# Altium schematic sheet DIY键盘V2.SchDoc
size 381 x 241 mm; SheetNumber: 1; SheetTotal: 1
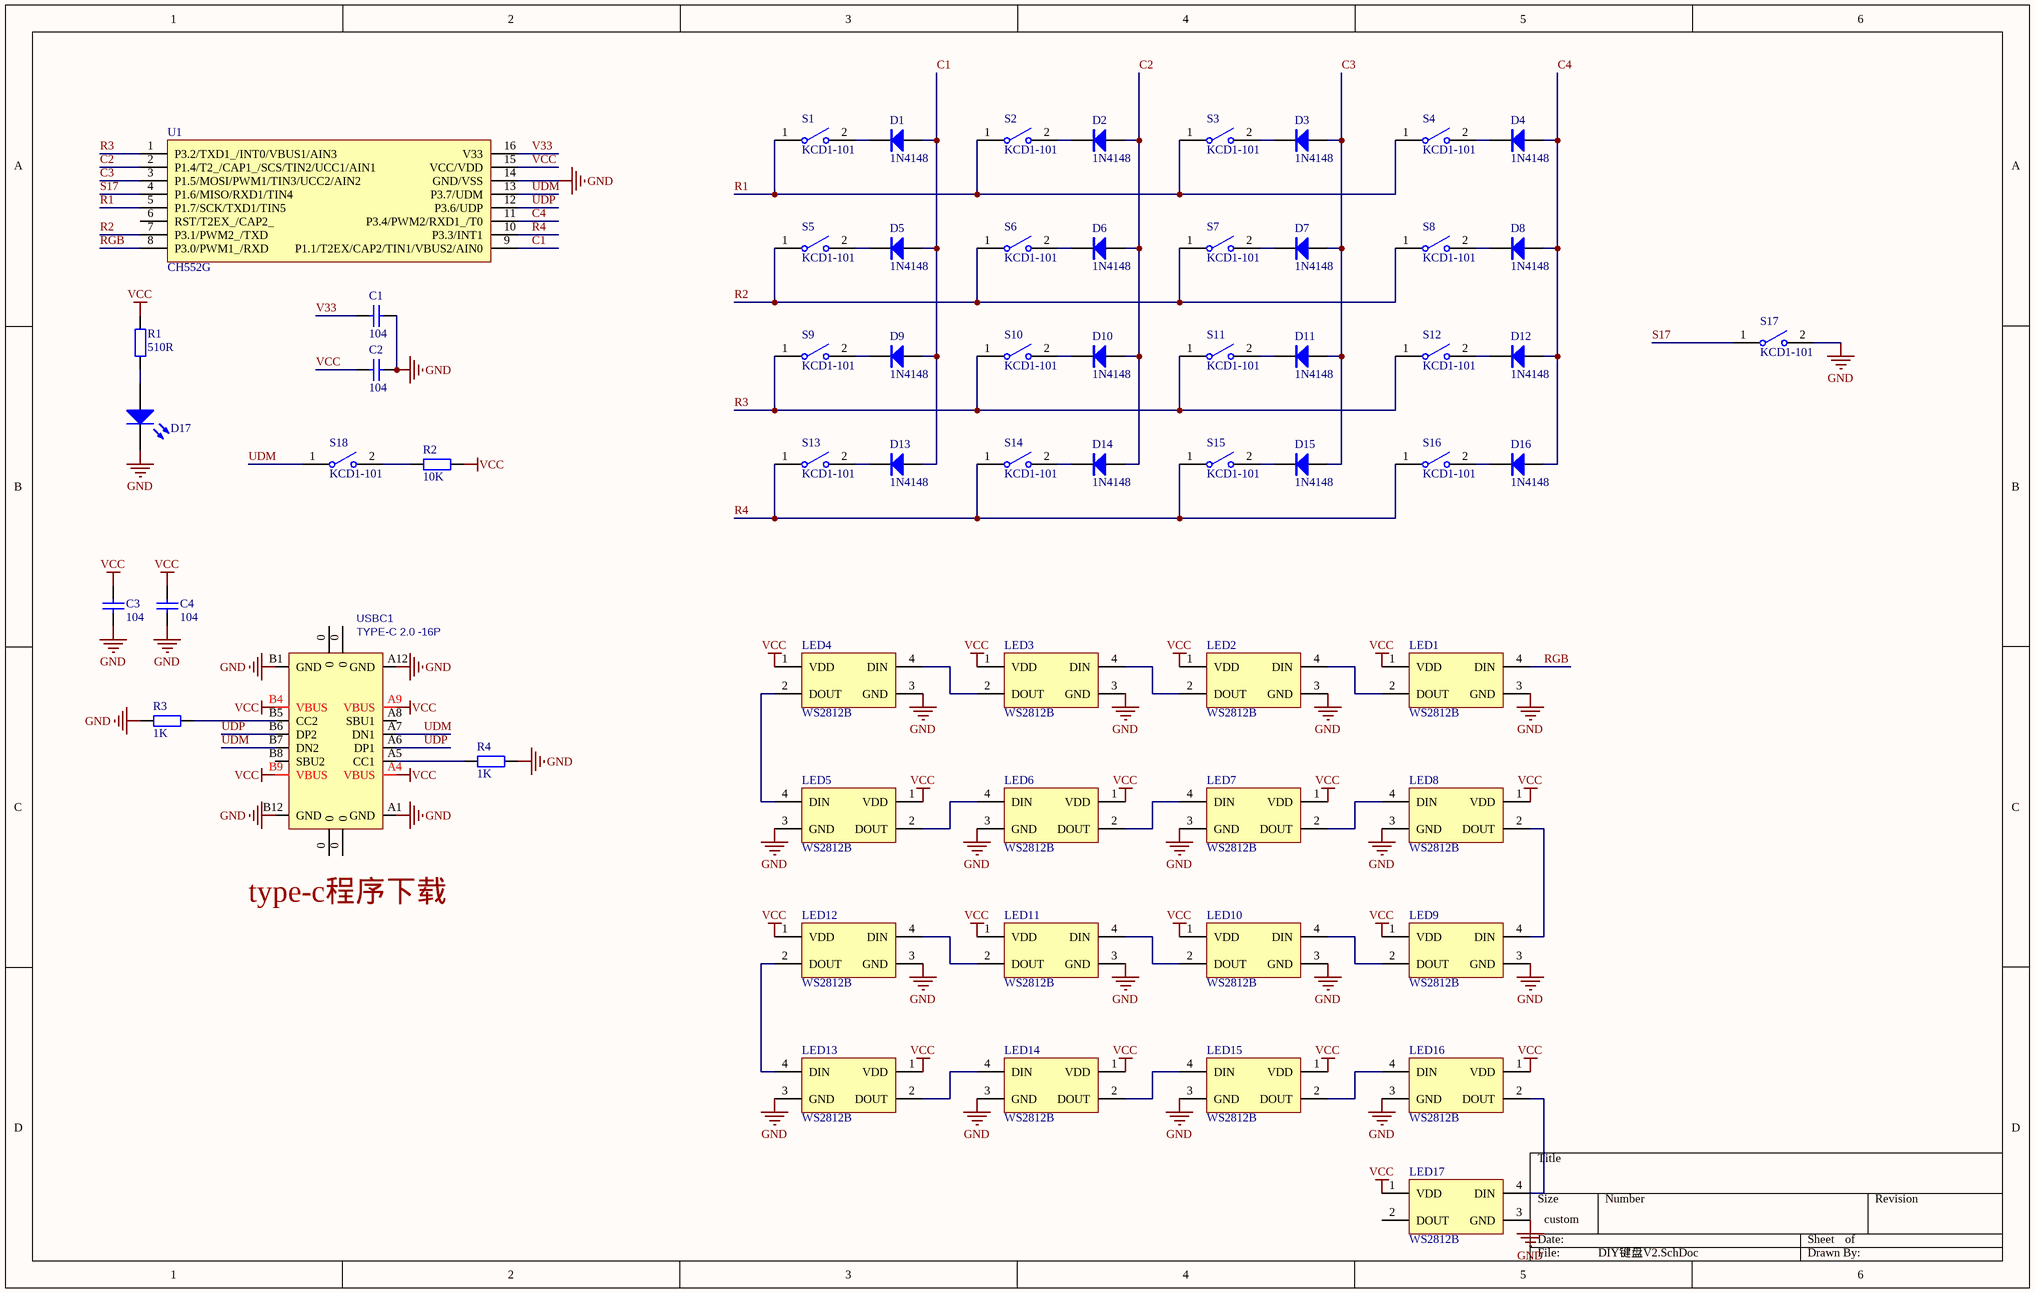
[diagram p0: DIY键盘V2.SchDoc]

## Parts
C1  104  [C0603_M]
C2  104  [C0603_M]
C3  104  [C0603_M]
C4  104  [C0603_M]
D1  1N4148  [SOD-323]
D2  1N4148  [SOD-323]
D3  1N4148  [SOD-323]
D4  1N4148  [SOD-323]
D5  1N4148  [SOD-323]
D6  1N4148  [SOD-323]
D7  1N4148  [SOD-323]
D8  1N4148  [SOD-323]
D9  1N4148  [SOD-323]
D10  1N4148  [SOD-323]
D11  1N4148  [SOD-323]
D12  1N4148  [SOD-323]
D13  1N4148  [SOD-323]
D14  1N4148  [SOD-323]
D15  1N4148  [SOD-323]
D16  1N4148  [SOD-323]
D17  LED  [LED0603_B]  (value not drawn)
LED1  WS2812B  [LED-SMD_L3.2-W2.8-BR_DY-S352818]
LED2  WS2812B  [LED-SMD_L3.2-W2.8-BR_DY-S352818]
LED3  WS2812B  [LED-SMD_L3.2-W2.8-BR_DY-S352818]
LED4  WS2812B  [LED-SMD_L3.2-W2.8-BR_DY-S352818]
LED5  WS2812B  [LED-SMD_L3.2-W2.8-BR_DY-S352818]
LED6  WS2812B  [LED-SMD_L3.2-W2.8-BR_DY-S352818]
LED7  WS2812B  [LED-SMD_L3.2-W2.8-BR_DY-S352818]
LED8  WS2812B  [LED-SMD_L3.2-W2.8-BR_DY-S352818]
LED9  WS2812B  [LED-SMD_L3.2-W2.8-BR_DY-S352818]
LED10  WS2812B  [LED-SMD_L3.2-W2.8-BR_DY-S352818]
LED11  WS2812B  [LED-SMD_L3.2-W2.8-BR_DY-S352818]
LED12  WS2812B  [LED-SMD_L3.2-W2.8-BR_DY-S352818]
LED13  WS2812B  [LED-SMD_L3.2-W2.8-BR_DY-S352818]
LED14  WS2812B  [LED-SMD_L3.2-W2.8-BR_DY-S352818]
LED15  WS2812B  [LED-SMD_L3.2-W2.8-BR_DY-S352818]
LED16  WS2812B  [LED-SMD_L3.2-W2.8-BR_DY-S352818]
LED17  WS2812B  [LED-SMD_L3.2-W2.8-BR_DY-S352818]
R1  510R  [R0603_M]
R2  10K  [R0603_M]
R3  1K  [R0603_M]
R4  1K  [R0603_M]
S1  KCD1-101  [KEY-TH_CPG1511F01S0X]
S2  KCD1-101  [KEY-TH_CPG1511F01S0X]
S3  KCD1-101  [KEY-TH_CPG1511F01S0X]
S4  KCD1-101  [KEY-TH_CPG1511F01S0X]
S5  KCD1-101  [KEY-TH_CPG1511F01S0X]
S6  KCD1-101  [KEY-TH_CPG1511F01S0X]
S7  KCD1-101  [KEY-TH_CPG1511F01S0X]
S8  KCD1-101  [KEY-TH_CPG1511F01S0X]
S9  KCD1-101  [KEY-TH_CPG1511F01S0X]
S10  KCD1-101  [KEY-TH_CPG1511F01S0X]
S11  KCD1-101  [KEY-TH_CPG1511F01S0X]
S12  KCD1-101  [KEY-TH_CPG1511F01S0X]
S13  KCD1-101  [KEY-TH_CPG1511F01S0X]
S14  KCD1-101  [KEY-TH_CPG1511F01S0X]
S15  KCD1-101  [KEY-TH_CPG1511F01S0X]
S16  KCD1-101  [KEY-TH_CPG1511F01S0X]
S17  KCD1-101  [KEY-TH_CPG1511F01S0X]
S18  KCD1-101  [SW SMD-3*6*2.5]
U1  CH552G  [SOP-16_L10.0-W3.9-P1.27-LS6.0-BL]
USBC1  TYPE-C 2.0 -16P  [USB-C-SMD_16P]

## Nets
GND: C1.1 C2.1 C3.1 C4.1 D17.2(K) LED1.3(GND) LED2.3(GND) LED3.3(GND) LED4.3(GND) LED5.3(GND) LED6.3(GND) LED7.3(GND) LED8.3(GND) LED9.3(GND) LED10.3(GND) LED11.3(GND) LED12.3(GND) LED13.3(GND) LED14.3(GND) LED15.3(GND) LED16.3(GND) LED17.3(GND) R3.2 R4.2 S17.2 U1.14(GND/VSS) USBC1.A1(GND) USBC1.A12(GND) USBC1.B1(GND) USBC1.B12(GND)
VCC: C2.2 C3.2 C4.2 LED1.1(VDD) LED2.1(VDD) LED3.1(VDD) LED4.1(VDD) LED5.1(VDD) LED6.1(VDD) LED7.1(VDD) LED8.1(VDD) LED9.1(VDD) LED10.1(VDD) LED11.1(VDD) LED12.1(VDD) LED13.1(VDD) LED14.1(VDD) LED15.1(VDD) LED16.1(VDD) LED17.1(VDD) R1.2 R2.2 U1.15(VCC/VDD) USBC1.A4(VBUS) USBC1.A9(VBUS) USBC1.B4(VBUS) USBC1.B9(VBUS)
C1: D1.1(A) D5.1(A) D9.1(A) D13.1(A) U1.9(P1.1/T2EX/CAP2/TIN1/VBUS2/AIN0)
C2: D2.1(A) D6.1(A) D10.1(A) D14.1(A) U1.2(P1.4/T2_/CAP1_/SCS/TIN2/UCC1/AIN1)
C3: D3.1(A) D7.1(A) D11.1(A) D15.1(A) U1.3(P1.5/MOSI/PWM1/TIN3/UCC2/AIN2)
C4: D4.1(A) D8.1(A) D12.1(A) D16.1(A) U1.11(P3.4/PWM2/RXD1_/T0)
R1: S1.1 S2.1 S3.1 S4.1 U1.5(P1.7/SCK/TXD1/TIN5)
R2: S5.1 S6.1 S7.1 S8.1 U1.7(P3.1/PWM2_/TXD)
R3: S9.1 S10.1 S11.1 S12.1 U1.1(P3.2/TXD1_/INT0/VBUS1/AIN3)
R4: S13.1 S14.1 S15.1 S16.1 U1.10(P3.3/INT1)
RGB: LED1.4(DIN) U1.8(P3.0/PWM1_/RXD)
S17: S17.1 U1.4(P1.6/MISO/RXD1/TIN4)
UDM: S18.1 U1.13(P3.7/UDM) USBC1.A7(DN1) USBC1.B7(DN2)
UDP: U1.12(P3.6/UDP) USBC1.A6(DP1) USBC1.B6(DP2)
V33: C1.2 U1.16(V33)
NetD1_2: D1.2(K) S1.2
NetD2_2: D2.2(K) S2.2
NetD3_2: D3.2(K) S3.2
NetD4_2: D4.2(K) S4.2
NetD5_2: D5.2(K) S5.2
NetD6_2: D6.2(K) S6.2
NetD7_2: D7.2(K) S7.2
NetD8_2: D8.2(K) S8.2
NetD9_2: D9.2(K) S9.2
NetD10_2: D10.2(K) S10.2
NetD11_2: D11.2(K) S11.2
NetD12_2: D12.2(K) S12.2
NetD13_2: D13.2(K) S13.2
NetD14_2: D14.2(K) S14.2
NetD15_2: D15.2(K) S15.2
NetD16_2: D16.2(K) S16.2
NetD17_1: D17.1(A) R1.1
NetLED1_2: LED1.2(DOUT) LED2.4(DIN)
NetLED2_2: LED2.2(DOUT) LED3.4(DIN)
NetLED3_2: LED3.2(DOUT) LED4.4(DIN)
NetLED4_2: LED4.2(DOUT) LED5.4(DIN)
NetLED5_2: LED5.2(DOUT) LED6.4(DIN)
NetLED6_2: LED6.2(DOUT) LED7.4(DIN)
NetLED7_2: LED7.2(DOUT) LED8.4(DIN)
NetLED8_2: LED8.2(DOUT) LED9.4(DIN)
NetLED9_2: LED9.2(DOUT) LED10.4(DIN)
NetLED10_2: LED10.2(DOUT) LED11.4(DIN)
NetLED11_2: LED11.2(DOUT) LED12.4(DIN)
NetLED12_2: LED12.2(DOUT) LED13.4(DIN)
NetLED13_2: LED13.2(DOUT) LED14.4(DIN)
NetLED14_2: LED14.2(DOUT) LED15.4(DIN)
NetLED15_2: LED15.2(DOUT) LED16.4(DIN)
NetLED16_2: LED16.2(DOUT) LED17.4(DIN)
NetR2_1: R2.1 S18.2
NetR3_1: R3.1 USBC1.B5(CC2)
NetR4_1: R4.1 USBC1.A5(CC1)

Not connected (* = marked no-connect by the designer): LED17 2(DOUT); U1 6(RST/T2EX_/CAP2_); USBC1 0 A8(SBU1) B8(SBU2)

## Notes on the sheet
- (near USBC1) type-c程序下载

## Library data of the parts
C1-C4 = C: 贴片电容/MLCC电容; BOM名称: 无极性贴片电容; 联系卖家，免费查找封装: 唯一出售店铺网址https://shop463601444.taobao.com
D1-D16 = 1N4148: 开关二极管; BOM名称: 高速开关二极管; 以赠品形式获赠本封装库的买家，还可联系卖家免费指导AD软件使用: 封装库来自淘宝卖家ID：黄晶宝石
D17 = LED: 发光二极管; 封装库来自淘宝卖家ID：黄晶宝石: 其他店铺购入均为盗版封装库，请立即申请退款，本店现金奖励20~200元
LED1-LED17 = WS2812B: WS2812B反贴
R1-R4 = R: 贴片电阻; 联系卖家，免费查找封装: 唯一出售店铺网址https://shop463601444.taobao.com; BOM名称: 贴片电阻
S1-S18 = KCD1-101: 1路单刀船型开关; 联系卖家，免费查找封装: 唯一出售店铺网址https://shop463601444.taobao.com; 封装库来自淘宝卖家ID：黄晶宝石: 其他店铺购入的，请立即申请退款，本店现金奖励20~500元; BOM名称: 1路单刀船型开关
U1 = CH552G: 8 DIgits
USBC1 = USB2.0_Type-C_16Pin: USB2.0_Type-C_16Pin母座; 联系卖家 免费技术支持: 封装库来自淘宝卖家ID：黄晶宝石